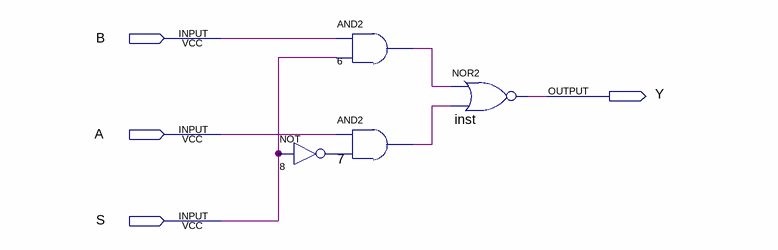
[diagram p0: schematic sheet]
// Quartus schematic MUX.bdf as structural Verilog: 4 symbols, 4 pins
module MUX (
  input  B,
  input  A,
  input  S,
  output Y
);

  wire n6_out, n7_out, n8_out;

  not u_8 (n8_out, S);
  and u_6 (n6_out, B, S);
  and u_7 (n7_out, A, n8_out);
  nor inst (Y, n6_out, n7_out);
endmodule
